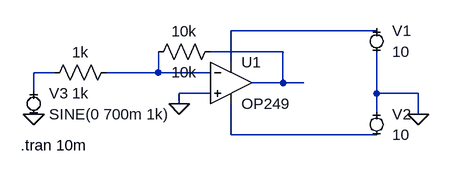
[diagram p0: schematic 1_інвертуючий підс.asc]
1_інвертуючий підс.asc, the LTspice schematic file:
Version 4
SHEET 1 880 680
WIRE 336 64 112 64
WIRE 192 96 80 96
WIRE 112 112 112 64
WIRE -160 128 -192 128
WIRE 0 128 0 96
WIRE 0 128 -80 128
WIRE 80 128 0 128
WIRE 192 144 192 96
WIRE 192 144 144 144
WIRE 224 144 192 144
WIRE -192 160 -192 128
WIRE 80 160 32 160
WIRE 336 160 336 96
WIRE 400 160 336 160
WIRE 32 176 32 160
WIRE 336 192 336 160
WIRE 400 192 400 160
WIRE 112 224 112 176
WIRE 336 224 112 224
FLAG 400 192 0
FLAG 32 176 0
FLAG -192 192 0
SYMBOL EXTRA\\AudioOpamp\\AD\\OP249 112 144 R0
SYMATTR InstName U1
SYMBOL MiniSyms4\\voltage- 336 80 R0
WINDOW 123 0 0 Left 2
WINDOW 39 0 0 Left 2
SYMATTR InstName V1
SYMATTR Value 10
SYMBOL MiniSyms4\\voltage- 336 208 R0
WINDOW 123 0 0 Left 2
WINDOW 39 0 0 Left 2
SYMATTR InstName V2
SYMATTR Value 10
SYMBOL res 96 80 R90
WINDOW 0 0 56 VBottom 2
WINDOW 3 32 56 VTop 2
SYMATTR InstName 10k
SYMATTR Value 10k
SYMBOL res -64 112 R90
WINDOW 0 0 56 VBottom 2
WINDOW 3 32 56 VTop 2
SYMATTR InstName 1k
SYMATTR Value 1k
SYMBOL MiniSyms4\\voltage- -192 176 R0
WINDOW 123 0 0 Left 2
WINDOW 39 0 0 Left 2
SYMATTR InstName V3
SYMATTR Value SINE(0 700m 1k)
TEXT -212 240 Left 2 !.tran 10m

The netlist it stands for:
* 1_інвертуючий підс.asc
* U1: OP249 (symbol EXTRA\AudioOpamp\AD\OP249 not available, pins judged from their places): In+=0 In-=N004 V+=N001 V-=N005 OUT=N002
V1 N001 0 10
V2 0 N005 10
R§10k N002 N004 10k
R§1k N004 N003 1k
V3 N003 0 SINE(0 700m 1k)
.tran 10m
.backanno
.end